# EAGLE design shield_2016 (EAGLE 7.5.0)
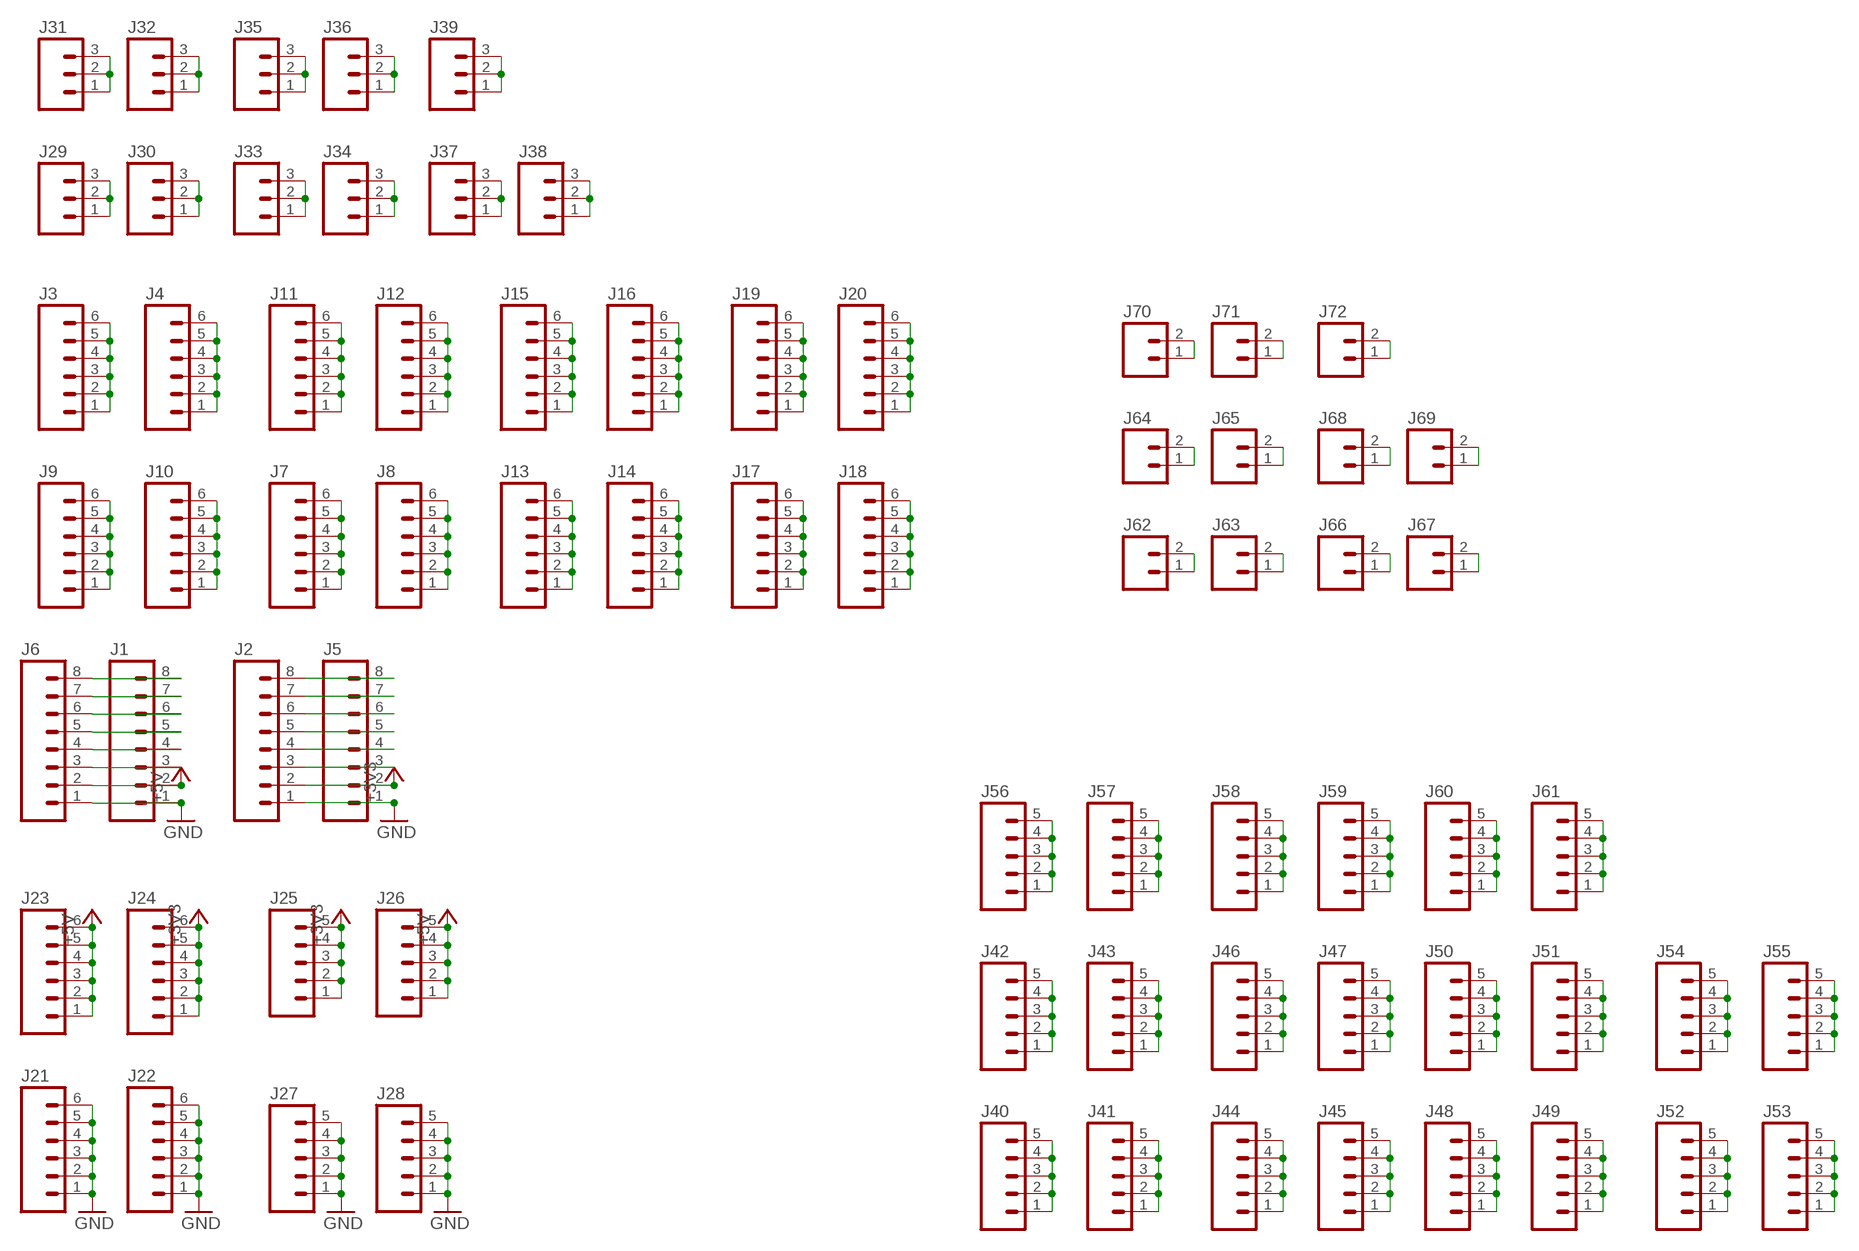
[diagram p0: schematic, sheet 1]

## Parts
J1  M08  [1X08_ROUND]
J2  M08  [1X08_ROUND]
J3  M06SILK_FEMALE_PTH  [1X06]
J4  M06SILK_FEMALE_PTH  [1X06]
J5  M08  [1X08_ROUND]
J6  M08  [1X08_ROUND]
J7  M06SILK_FEMALE_PTH  [1X06]
J8  M06SILK_FEMALE_PTH  [1X06]
J9  M06SILK_FEMALE_PTH  [1X06]
J10  M06SILK_FEMALE_PTH  [1X06]
J11  M06SILK_FEMALE_PTH  [1X06]
J12  M06SILK_FEMALE_PTH  [1X06]
J13  M06SILK_FEMALE_PTH  [1X06]
J14  M06SILK_FEMALE_PTH  [1X06]
J15  M06SILK_FEMALE_PTH  [1X06]
J16  M06SILK_FEMALE_PTH  [1X06]
J17  M06SILK_FEMALE_PTH  [1X06]
J18  M06SILK_FEMALE_PTH  [1X06]
J19  M06SILK_FEMALE_PTH  [1X06]
J20  M06SILK_FEMALE_PTH  [1X06]
J21  M06SILK_FEMALE_PTH  [1X06]
J22  M06SILK_FEMALE_PTH  [1X06]
J23  M06SILK_FEMALE_PTH  [1X06]
J24  M06SILK_FEMALE_PTH  [1X06]
J25  M05PTH  [1X05]
J26  M05PTH  [1X05]
J27  M05PTH  [1X05]
J28  M05PTH  [1X05]
J29  M03PTH  [1X03]
J30  M03PTH  [1X03]
J31  M03PTH  [1X03]
J32  M03PTH  [1X03]
J33  M03PTH  [1X03]
J34  M03PTH  [1X03]
J35  M03PTH  [1X03]
J36  M03PTH  [1X03]
J37  M03PTH  [1X03]
J38  M03PTH  [1X03]
J39  M03PTH  [1X03]
J40  M05PTH  [1X05]
J41  M05PTH  [1X05]
J42  M05PTH  [1X05]
J43  M05PTH  [1X05]
J44  M05PTH  [1X05]
J45  M05PTH  [1X05]
J46  M05PTH  [1X05]
J47  M05PTH  [1X05]
J48  M05PTH  [1X05]
J49  M05PTH  [1X05]
J50  M05PTH  [1X05]
J51  M05PTH  [1X05]
J52  M05PTH  [1X05]
J53  M05PTH  [1X05]
J54  M05PTH  [1X05]
J55  M05PTH  [1X05]
J56  M05PTH  [1X05]
J57  M05PTH  [1X05]
J58  M05PTH  [1X05]
J59  M05PTH  [1X05]
J60  M05PTH  [1X05]
J61  M05PTH  [1X05]
J62  M02PTH  [1X02]
J63  M02PTH  [1X02]
J64  M02PTH  [1X02]
J65  M02PTH  [1X02]
J66  M02PTH  [1X02]
J67  M02PTH  [1X02]
J68  M02PTH  [1X02]
J69  M02PTH  [1X02]
J70  M02PTH  [1X02]
J71  M02PTH  [1X02]
J72  M02PTH  [1X02]

## Nets
+3V3: J2.2 J5.2 J24.1 J24.2 J24.3 J24.4 J24.5 J24.6 J25.1 J25.2 J25.3 J25.4 J25.5
+5V: J1.2 J6.2 J23.1 J23.2 J23.3 J23.4 J23.5 J23.6 J26.1 J26.2 J26.3 J26.4 J26.5
GND: J1.1 J2.1 J5.1 J6.1 J21.1 J21.2 J21.3 J21.4 J21.5 J21.6 J22.1 J22.2 J22.3 J22.4 J22.5 J22.6 J27.1 J27.2 J27.3 J27.4 J27.5 J28.1 J28.2 J28.3 J28.4 J28.5
N$1: J3.1 J3.2 J3.3 J3.4 J3.5 J3.6
N$2: J4.1 J4.2 J4.3 J4.4 J4.5 J4.6
N$3: J29.1 J29.2 J29.3
N$4: J30.1 J30.2 J30.3
N$5: J1.3 J6.3
N$6: J1.4 J6.4
N$7: J1.5 J6.5
N$8: J1.6 J6.6
N$9: J1.7 J6.7
N$10: J1.8 J6.8
N$11: J31.1 J31.2 J31.3
N$12: J32.1 J32.2 J32.3
N$13: J2.3 J5.3
N$14: J2.4 J5.4
N$15: J2.5 J5.5
N$16: J2.6 J5.6
N$17: J2.7 J5.7
N$18: J2.8 J5.8
N$19: J7.1 J7.2 J7.3 J7.4 J7.5 J7.6
N$20: J8.1 J8.2 J8.3 J8.4 J8.5 J8.6
N$21: J9.1 J9.2 J9.3 J9.4 J9.5 J9.6
N$22: J10.1 J10.2 J10.3 J10.4 J10.5 J10.6
N$23: J11.1 J11.2 J11.3 J11.4 J11.5 J11.6
N$24: J12.1 J12.2 J12.3 J12.4 J12.5 J12.6
N$25: J13.1 J13.2 J13.3 J13.4 J13.5 J13.6
N$26: J14.1 J14.2 J14.3 J14.4 J14.5 J14.6
N$27: J15.1 J15.2 J15.3 J15.4 J15.5 J15.6
N$28: J16.1 J16.2 J16.3 J16.4 J16.5 J16.6
N$29: J17.1 J17.2 J17.3 J17.4 J17.5 J17.6
N$30: J18.1 J18.2 J18.3 J18.4 J18.5 J18.6
N$31: J19.1 J19.2 J19.3 J19.4 J19.5 J19.6
N$32: J20.1 J20.2 J20.3 J20.4 J20.5 J20.6
N$33: J33.1 J33.2 J33.3
N$34: J34.1 J34.2 J34.3
N$35: J35.1 J35.2 J35.3
N$36: J36.1 J36.2 J36.3
N$37: J37.1 J37.2 J37.3
N$38: J38.1 J38.2 J38.3
N$39: J39.1 J39.2 J39.3
N$40: J40.1 J40.2 J40.3 J40.4 J40.5
N$41: J41.1 J41.2 J41.3 J41.4 J41.5
N$42: J42.1 J42.2 J42.3 J42.4 J42.5
N$43: J43.1 J43.2 J43.3 J43.4 J43.5
N$44: J44.1 J44.2 J44.3 J44.4 J44.5
N$45: J45.1 J45.2 J45.3 J45.4 J45.5
N$46: J46.1 J46.2 J46.3 J46.4 J46.5
N$47: J47.1 J47.2 J47.3 J47.4 J47.5
N$48: J48.1 J48.2 J48.3 J48.4 J48.5
N$49: J49.1 J49.2 J49.3 J49.4 J49.5
N$50: J50.1 J50.2 J50.3 J50.4 J50.5
N$51: J51.1 J51.2 J51.3 J51.4 J51.5
N$52: J52.1 J52.2 J52.3 J52.4 J52.5
N$53: J53.1 J53.2 J53.3 J53.4 J53.5
N$54: J54.1 J54.2 J54.3 J54.4 J54.5
N$55: J55.1 J55.2 J55.3 J55.4 J55.5
N$56: J56.1 J56.2 J56.3 J56.4 J56.5
N$57: J57.1 J57.2 J57.3 J57.4 J57.5
N$58: J58.1 J58.2 J58.3 J58.4 J58.5
N$59: J59.1 J59.2 J59.3 J59.4 J59.5
N$60: J60.1 J60.2 J60.3 J60.4 J60.5
N$61: J61.1 J61.2 J61.3 J61.4 J61.5
N$62: J62.1 J62.2
N$63: J63.1 J63.2
N$64: J64.1 J64.2
N$65: J65.1 J65.2
N$66: J66.1 J66.2
N$67: J67.1 J67.2
N$68: J68.1 J68.2
N$69: J69.1 J69.2
N$70: J70.1 J70.2
N$71: J71.1 J71.2
N$72: J72.1 J72.2

## Library data of the parts
J1 J2 J5 J6 = me433_2016:M08: Header 8 Standard 8-pin 0.1" header. Use with straight break away headers (SKU : PRT-00116), right angle break away headers (PRT-00553), swiss pins (PRT-00743), machine pins (PRT-00117), and female headers (PRT-00115).; PROD_ID: CONN-08437
J3 J4 J7-J24 = SparkFun-Connectors:M06: Header 6 Standard 6-pin 0.1" header. Use with straight break away headers (SKU : PRT-00116), right angle break away headers (PRT-00553), swiss pins (PRT-00743), machine pins (PRT-00117), and female headers (PRT-00115). Molex polarized connector foot print use with SKU : PRT-08094 with associated crimp pins and housings. NOTES ON THE VARIANTS LOCK and LOCK_LONGPADS... This footprint was designed to help hold the alignment of a through-hole component (i.e. 6-pin header) while soldering it into place. You may notice that each hole has been shifted either up or down by 0.005 of an inch from it's more standard position (which is a perfectly straight line). This slight alteration caused the pins (the squares in the middle) to touch the edges of the holes. Because they are alternating, it causes a "brace" to hold the component in place. 0.005 has proven to be the perfect amount of "off-center" position when using our standard breakaway headers. Although looks a little odd when you look at the bare footprint, once you have a header in there, the alteration is very hard to notice. Also,if you push a header all the way into place, it is covered up entirely on the bottom side. This idea of altering the position of holes to aid alignment will be further integrated into the Sparkfun Library for other footprints. It can help hold any component with 3 or more connection pins.; PROD_ID: CONN-08437
J25-J28 J40-J61 = SparkFun-Connectors:M05: Header 5 Standard 5-pin 0.1" header. Use with straight break away headers (SKU : PRT-00116), right angle break away headers (PRT-00553), swiss pins (PRT-00743), machine pins (PRT-00117), and female headers (PRT-00115). Molex polarized connector foot print use with SKU : PRT-08230 with associated crimp pins and housings.
J29-J39 = SparkFun-Connectors:M03: Header 3 Standard 3-pin 0.1" header. Use with straight break away headers (SKU : PRT-00116), right angle break away headers (PRT-00553), swiss pins (PRT-00743), machine pins (PRT-00117), and female headers (PRT-00115). Molex polarized connector foot print use with SKU : PRT-08232 with associated crimp pins and housings.
J62-J72 = SparkFun-Connectors:M02: Standard 2-pin 0.1" header. Use with - straight break away headers ( PRT-00116) - right angle break away headers (PRT-00553) - swiss pins (PRT-00743) - machine pins (PRT-00117) - female headers (PRT-00115) Molex polarized connector foot print use with: PRT-08233 with associated crimp pins and housings. 2.54_SCREWTERM for use with PRT-10571. 3.5mm Screw Terminal footprints for PRT-08084 5mm Screw Terminal footprints for use with PRT-08432

## Board
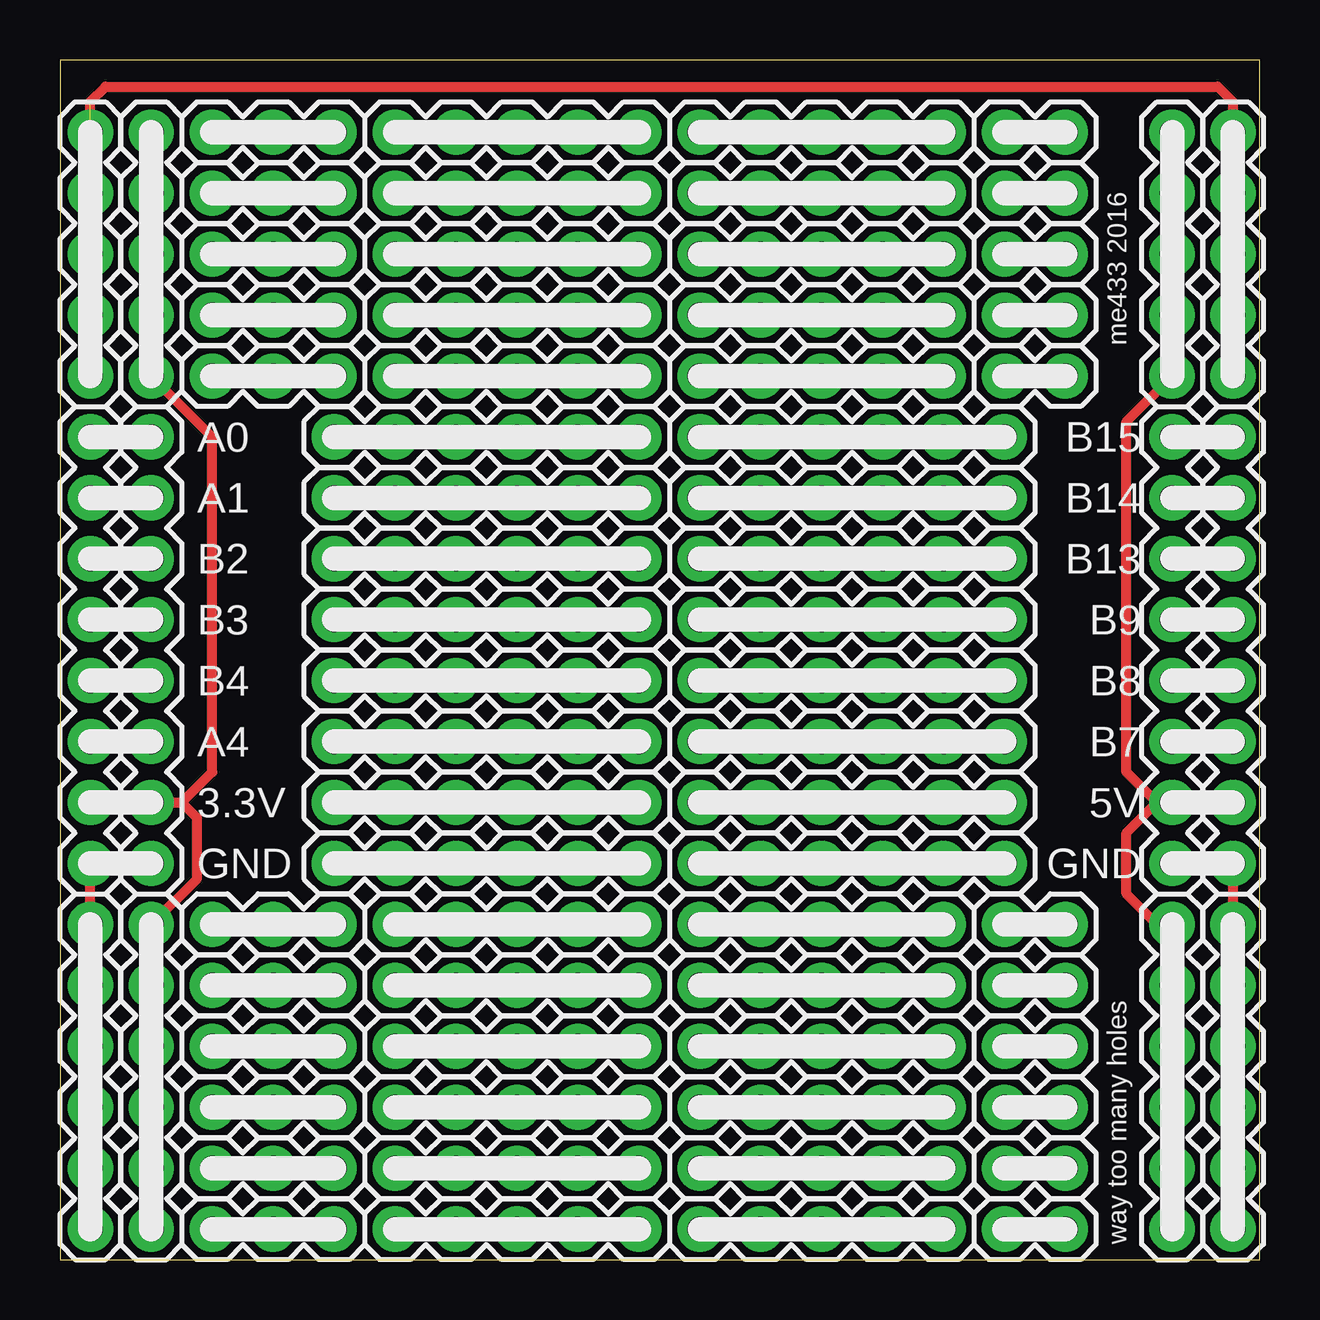
[diagram p1: board, top side]
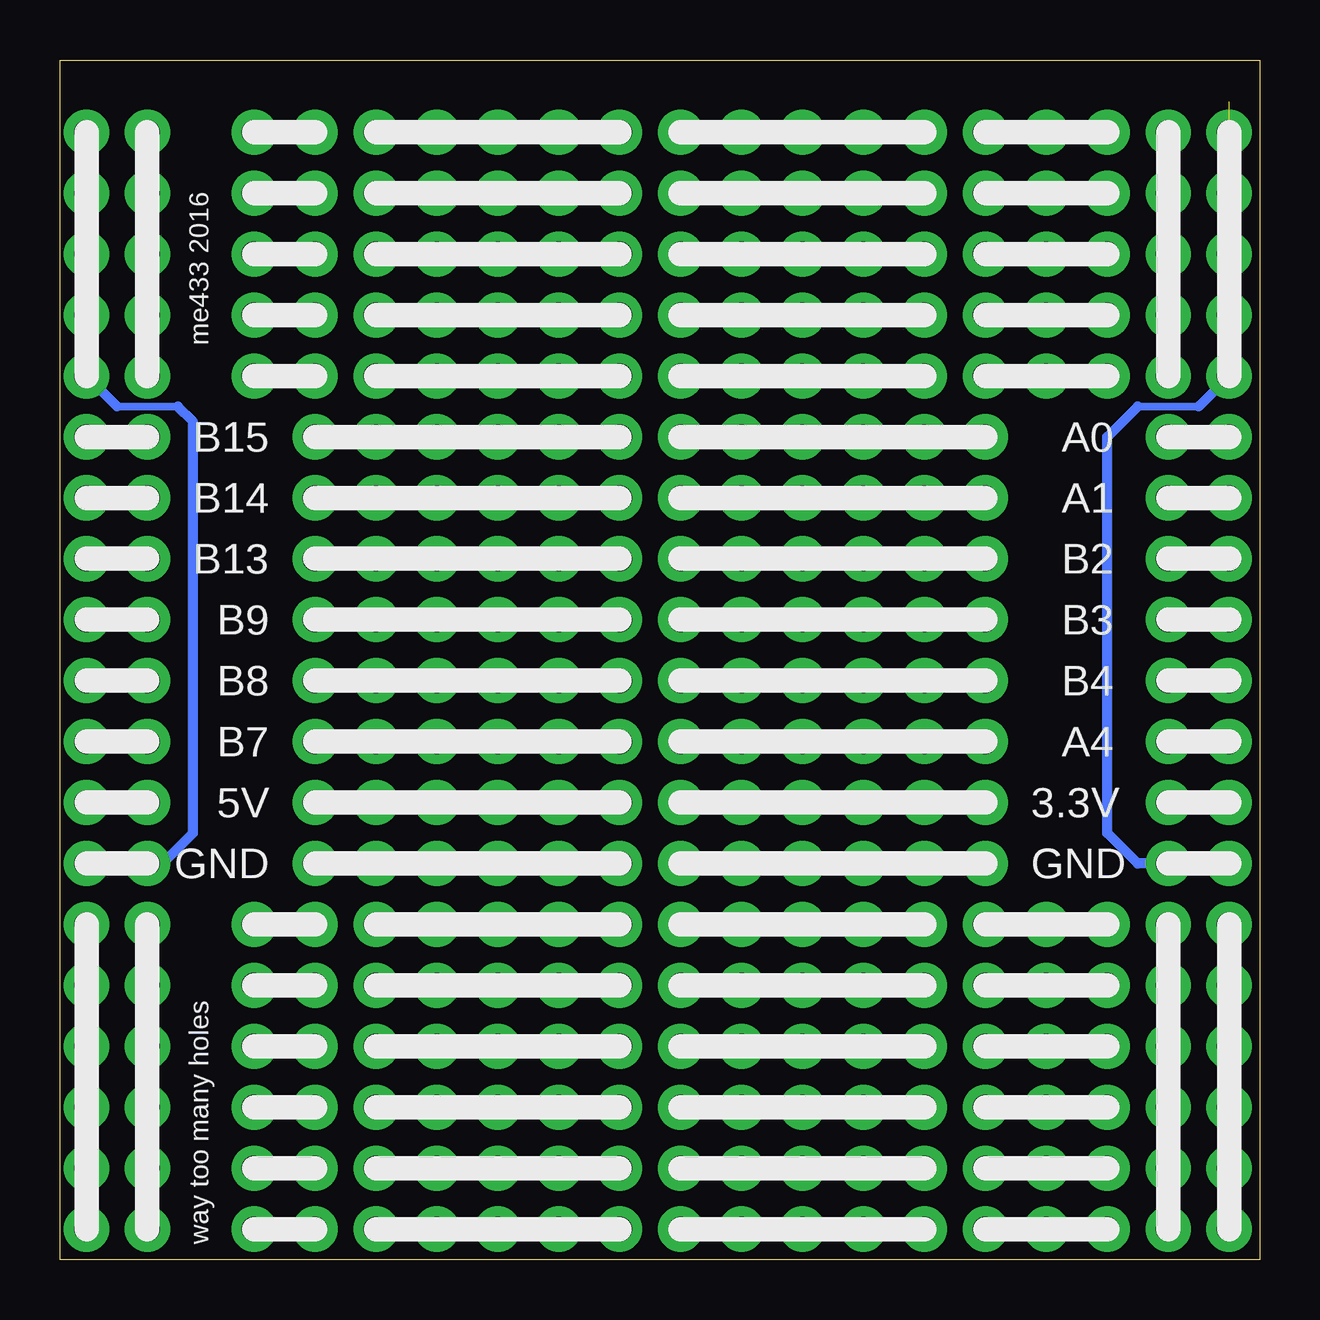
[diagram p2: board, bottom side, seen from below]

Size 50 x 50 mm. Coordinates in mm from the lower left corner, seen from the top.
Outline: 0,0 50,0 50,50 0,50 0,0
Copper layers (1*16): Top 0.035mm / dielectric 1.5mm / Bottom 0.035mm
Design rules "SeeedStudio_2layer_DRU_no_angle_20140221": minimum track width 6mil, minimum drill 12mil, track to track 6mil, track to pad 6mil, pad to pad 6mil, via to via 6mil, smd to smd 0mil, copper to edge 10mil, drill to drill 10mil, minimum pad ring 10mil, minimum via ring 6mil, stop-mask expansion 2mil, vias tented up to drill 100mil, thermal gap 10mil

### Footprints (pad centres in the part's own frame; a part is rotated, then mirrored left to right if it is on the bottom)
1X08_ROUND = drill 1.016 pad 1.88: 1 0,0; 2 2.54,0; 3 5.08,0; 4 7.62,0; 5 10.16,0; 6 12.7,0; 7 15.24,0; 8 17.78,0
1X06 = drill 1.016 pad 1.88: 1 0,0; 2 2.54,0; 3 5.08,0; 4 7.62,0; 5 10.16,0; 6 12.7,0
1X05 = drill 1.016 pad 1.88: 1 0,0; 2 2.54,0; 3 5.08,0; 4 7.62,0; 5 10.16,0
1X03 = drill 1.016 pad 1.88: 1 0,0; 2 2.54,0; 3 5.08,0
1X02 = drill 1.016 pad 1.88: 1 0,0; 2 2.54,0

### Placement (x,y rotation side)
J1  48.9,16.51 90 top
J2  1.27,16.51 90 top
J3  11.43,19.05 0 top
J4  11.43,34.29 0 top
J5  3.81,16.51 90 top
J6  46.35,16.51 90 top
J7  11.43,31.75 0 top
J8  11.43,29.21 0 top
J9  11.43,16.51 0 top
J10  26.67,16.51 0 top
J11  11.43,26.67 0 top
J12  11.43,24.13 0 top
J13  11.43,21.59 0 top
J14  26.67,19.05 0 top
J15  26.67,21.59 0 top
J16  26.67,24.13 0 top
J17  26.67,26.67 0 top
J18  26.67,29.21 0 top
J19  26.67,31.75 0 top
J20  26.67,34.29 0 top
J21  1.27,1.27 90 top
J22  48.9,1.27 90 top
J23  46.35,1.27 90 top
J24  3.81,1.27 90 top
J25  3.81,36.83 90 top
J26  46.35,36.83 90 top
J27  1.27,36.83 90 top
J28  48.9,36.83 90 top
J29  6.35,13.97 0 top
J30  6.35,8.89 0 top
J31  6.35,3.81 0 top
J32  6.35,46.99 0 top
J33  6.35,41.91 0 top
J34  6.35,36.83 0 top
J35  6.35,11.43 0 top
J36  6.35,6.35 0 top
J37  6.35,1.27 0 top
J38  6.35,44.45 0 top
J39  6.35,39.37 0 top
J40  13.97,13.97 0 top
J41  13.97,8.89 0 top
J42  13.97,3.81 0 top
J43  26.67,13.97 0 top
J44  26.67,8.89 0 top
J45  26.67,3.81 0 top
J46  13.97,46.99 0 top
J47  26.67,44.45 0 top
J48  26.67,39.37 0 top
J49  13.97,44.45 0 top
J50  13.97,11.43 0 top
J51  13.97,6.35 0 top
J52  13.97,1.27 0 top
J53  26.67,11.43 0 top
J54  26.67,6.35 0 top
J55  26.67,1.27 0 top
J56  26.67,46.99 0 top
J57  26.67,41.91 0 top
J58  26.67,36.83 0 top
J59  13.97,41.91 0 top
J60  13.97,36.83 0 top
J61  13.97,39.37 0 top
J62  39.37,13.97 0 top
J63  39.37,8.89 0 top
J64  39.37,3.81 0 top
J65  39.37,46.99 0 top
J66  39.37,11.43 0 top
J67  39.37,6.35 0 top
J68  39.37,1.27 0 top
J69  39.37,44.45 0 top
J70  39.37,39.37 0 top
J71  39.37,36.83 0 top
J72  39.37,41.91 0 top

### Tracks (layer width: path | path; a pad name or v marks a point on that pad's centre or on a via)
+3V3  (7 unrouted)
  Top 0.406: J2.2 J5.2 5.08,19.05 | J25.5 J25.1 6.35,34.29 6.35,20.32 5.08,19.05 | J24.1 J24.6 5.71,15.88 5.71,18.41 5.08,19.05
+5V  (7 unrouted)
  Top 0.406: J23.1 J23.6 45.72,13.97 44.45,15.24 44.45,17.78 45.72,19.05 | J1.2 J6.2 45.72,19.05 | J26.5 J26.1 44.45,34.92 44.45,20.32 45.72,19.05
GND  (15 unrouted)
  Top 0.406: J5.1 J2.1 J21.6 J21.1 | J22.1 J22.6 J1.1 J6.1 | J28.1 J28.5 48.9,48.26 48.26,48.9 1.91,48.9 1.27,48.26 J27.1
  Bottom 0.305: 5.08,35.56 2.54,35.56 | 45.09,35.56 47.62,35.56
  Bottom 0.406: J5.1 5.08,16.51 6.35,17.78 6.35,34.29 5.08,35.56 | 2.54,35.56 J27.1 | J6.1 45.72,16.51 44.45,17.78 44.45,34.92 45.09,35.56 | 47.62,35.56 J28.1
N$1  (4 unrouted)
  Top 0.406: J3.1 J3.6
N$2  (4 unrouted)
  Top 0.406: J4.1 J4.6
N$3  (1 unrouted)
  Top 0.406: J29.1 J29.3
N$4  (1 unrouted)
  Top 0.406: J30.1 J30.3
N$5
  Top 0.406: J6.3 J1.3
N$6
  Top 0.406: J6.4 J1.4
N$7
  Top 0.406: J6.5 J1.5
N$8
  Top 0.406: J6.6 J1.6
N$9
  Top 0.406: J6.7 J1.7
N$10
  Top 0.406: J6.8 J1.8
N$11  (1 unrouted)
  Top 0.406: J31.1 J31.3
N$12  (1 unrouted)
  Top 0.406: J32.1 J32.3
N$13
  Top 0.406: J2.3 J5.3
N$14
  Top 0.406: J2.4 J5.4
N$15
  Top 0.406: J2.5 J5.5
N$16
  Top 0.406: J2.6 J5.6
N$17
  Top 0.406: J2.7 J5.7
N$18
  Top 0.406: J2.8 J5.8
N$19  (4 unrouted)
  Top 0.406: J7.1 J7.6
N$20  (4 unrouted)
  Top 0.406: J8.1 J8.6
N$21  (4 unrouted)
  Top 0.406: J9.1 J9.6
N$22  (4 unrouted)
  Top 0.406: J10.6 J10.1
N$23  (4 unrouted)
  Top 0.406: J11.1 J11.6
N$24  (4 unrouted)
  Top 0.406: J12.1 J12.6
N$25  (4 unrouted)
  Top 0.406: J13.1 J13.6
N$26  (4 unrouted)
  Top 0.406: J14.6 J14.1
N$27  (4 unrouted)
  Top 0.406: J15.6 J15.1
N$28  (4 unrouted)
  Top 0.406: J16.6 J16.1
N$29  (4 unrouted)
  Top 0.406: J17.6 J17.1
N$30  (4 unrouted)
  Top 0.406: J18.6 J18.1
N$31  (4 unrouted)
  Top 0.406: J19.6 J19.1
N$32  (4 unrouted)
  Top 0.406: J20.6 J20.1
N$33  (1 unrouted)
  Top 0.406: J33.1 J33.3
N$34  (1 unrouted)
  Top 0.406: J34.1 J34.3
N$35  (1 unrouted)
  Top 0.406: J35.1 J35.3
N$36  (1 unrouted)
  Top 0.406: J36.1 J36.3
N$37  (1 unrouted)
  Top 0.406: J37.1 J37.3
N$38  (1 unrouted)
  Top 0.406: J38.1 J38.3
N$39  (1 unrouted)
  Top 0.406: J39.1 J39.3
N$40  (3 unrouted)
  Top 0.406: J40.1 J40.5
N$41  (3 unrouted)
  Top 0.406: J41.1 J41.5
N$42  (3 unrouted)
  Top 0.406: J42.1 J42.5
N$43  (3 unrouted)
  Top 0.406: J43.1 J43.5
N$44  (3 unrouted)
  Top 0.406: J44.1 J44.5
N$45  (3 unrouted)
  Top 0.406: J45.5 J45.1
N$46  (3 unrouted)
  Top 0.406: J46.1 J46.5
N$47  (3 unrouted)
  Top 0.406: J47.5 J47.1
N$48  (3 unrouted)
  Top 0.406: J48.5 J48.1
N$49  (3 unrouted)
  Top 0.406: J49.5 J49.1
N$50  (3 unrouted)
  Top 0.406: J50.5 J50.1
N$51  (3 unrouted)
  Top 0.406: J51.1 J51.5
N$52  (3 unrouted)
  Top 0.406: J52.1 J52.5
N$53  (3 unrouted)
  Top 0.406: J53.5 J53.1
N$54  (3 unrouted)
  Top 0.406: J54.5 J54.1
N$55  (3 unrouted)
  Top 0.406: J55.5 J55.1
N$56  (3 unrouted)
  Top 0.406: J56.1 J56.5
N$57  (3 unrouted)
  Top 0.406: J57.1 J57.5
N$58  (3 unrouted)
  Top 0.406: J58.1 J58.5
N$59  (3 unrouted)
  Top 0.406: J59.1 J59.5
N$60  (3 unrouted)
  Top 0.406: J60.1 J60.5
N$61  (3 unrouted)
  Top 0.406: J61.5 J61.1
N$62
  Top 0.406: J62.1 J62.2
N$63
  Top 0.406: J63.1 J63.2
N$64
  Top 0.406: J64.1 J64.2
N$65
  Top 0.406: J65.1 J65.2
N$66
  Top 0.406: J66.1 J66.2
N$67
  Top 0.406: J67.1 J67.2
N$68
  Top 0.406: J68.1 J68.2
N$69
  Top 0.406: J69.1 J69.2
N$70
  Top 0.406: J70.1 J70.2
N$71
  Top 0.406: J71.1 J71.2
N$72
  Top 0.406: J72.1 J72.2

### Text on the board
tPlace: me433 2016 | B15 | A0 | B14 | A1 | B13 | B2 | B9 | B3 | B8 | B4 | B7 | A4 | 5V | 3.3V | GND | GND | way too many holes
bPlace: me433 2016 | B15 | A0 | B14 | A1 | B13 | B2 | B9 | B3 | B8 | B4 | B7 | A4 | 5V | 3.3V | GND | GND | way too many holes